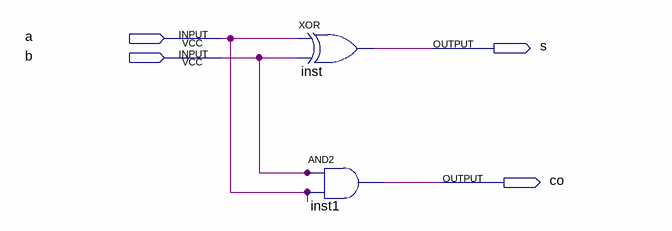
[diagram p0: schematic sheet]
// Quartus schematic ha.bdf as structural Verilog: 2 symbols, 4 pins
module ha (
  input  a,
  input  b,
  output s,
  output co
);

  xor inst (s, a, b);
  and inst1 (co, b, a);
endmodule
